# Altium schematic sheet 1S 2S.SchDoc
size A4; SheetNumber: 5; SheetTotal: 8
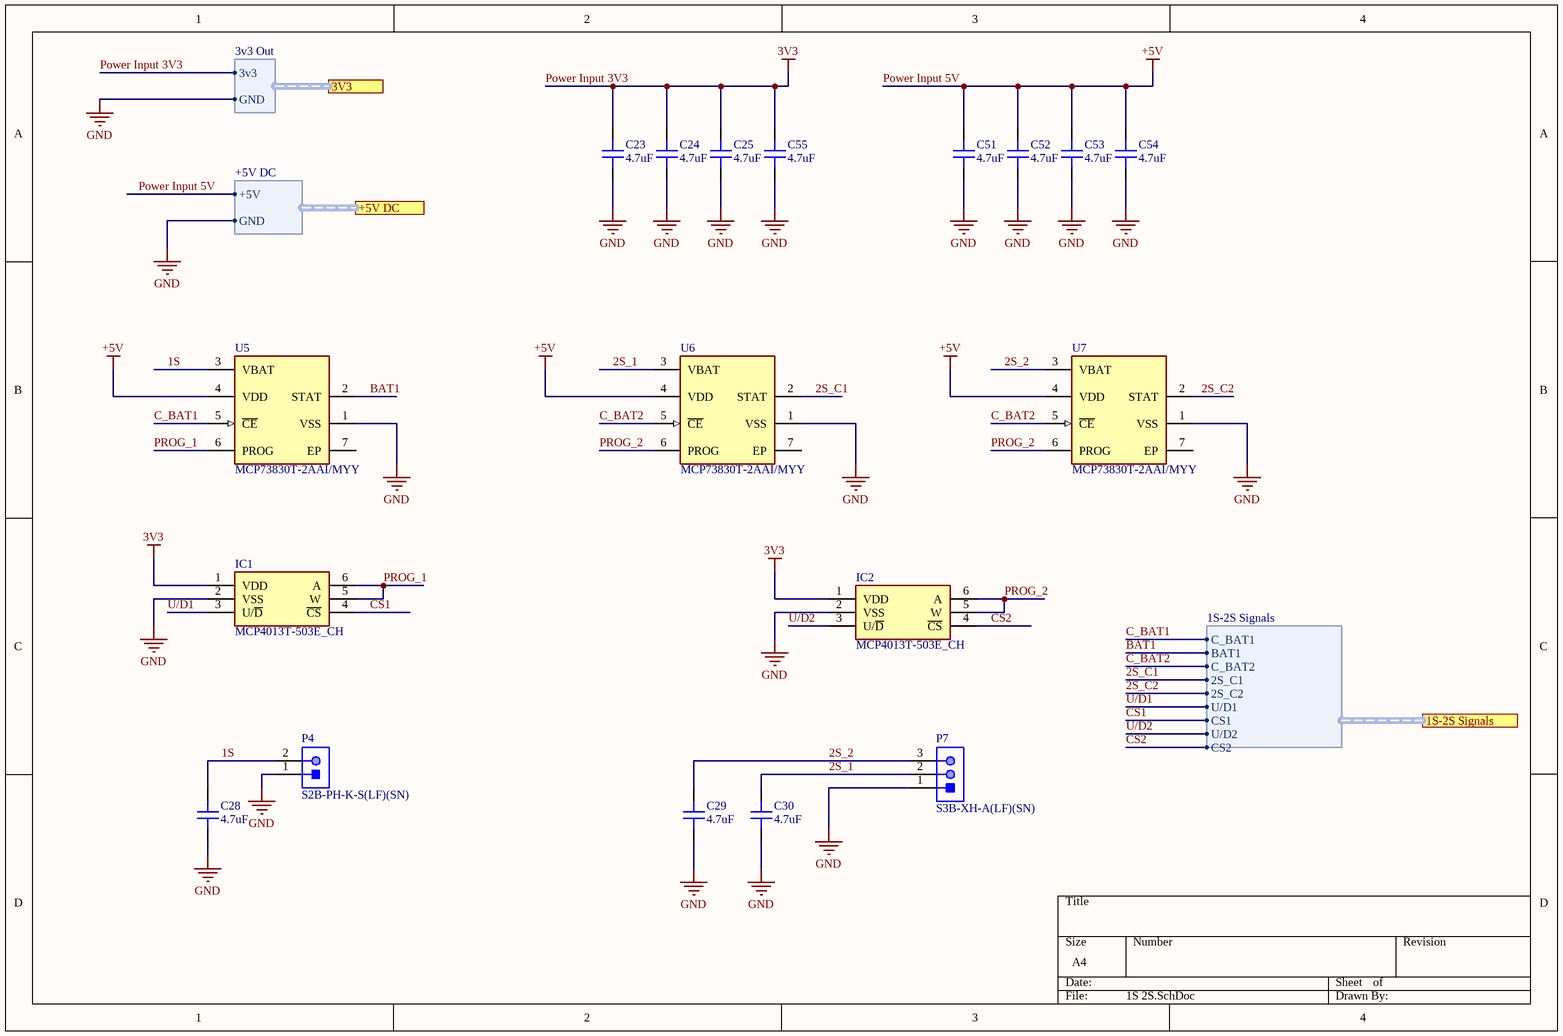
[diagram p0: 1S 2S.SchDoc]

## Parts
C23  4.7uF  [CAP 0603_1608]
C24  4.7uF  [CAP 0603_1608]
C25  4.7uF  [CAP 0603_1608]
C28  4.7uF  [CAP 0603_1608]
C29  4.7uF  [CAP 0603_1608]
C30  4.7uF  [CAP 0603_1608]
C51  4.7uF  [CAP 0603_1608]
C52  4.7uF  [CAP 0603_1608]
C53  4.7uF  [CAP 0603_1608]
C54  4.7uF  [CAP 0603_1608]
C55  4.7uF  [CAP 0603_1608]
IC1  MCP4013T-503E_CH  [SOT95P280X145-6N]
IC2  MCP4013T-503E_CH  [SOT95P280X145-6N]
P4  S2B-PH-K-S(LF)(SN)  [JST-S2B-PH-K-S_V]
P7  S3B-XH-A(LF)(SN)  [JST-S3B-XH-A(LF)(SN)_V]
U5  MCP73830T-2AAI/MYY  [FP-C04-078-IPC_B]
U6  MCP73830T-2AAI/MYY  [FP-C04-078-IPC_B]
U7  MCP73830T-2AAI/MYY  [FP-C04-078-IPC_B]

## Ports
1S-2S Signals (harness 1S-2S Signals), 3V3 (harness 3v3 Out), +5V DC (harness +5V DC)

## Harnesses
1S-2S Signals: C_BAT1, BAT1, 2S_C1, C_BAT2, 2S_C2, U/D1, CS1, U/D2, CS2
3v3 Out: 3v3, GND
+5V DC: +5V, GND

## Nets
GND: C23.1 C24.1 C25.1 C28.1 C29.1 C30.1 C51.1 C52.1 C53.1 C54.1 C55.1 IC1.2(VSS) IC2.2(VSS) P4.1 P7.1 U5.1(VSS) U6.1(VSS) U7.1(VSS) ; port 3V3.GND, port +5V DC.GND
Power Input 3V3: C23.2 C24.2 C25.2 C55.2 IC1.1(VDD) IC2.1(VDD) ; port 3V3.3v3  [also labelled 3V3]
Power Input 5V: C51.2 C52.2 C53.2 C54.2 U5.4(VDD) U6.4(VDD) U7.4(VDD) ; port +5V DC.+5V  [also labelled +5V]
1S: C28.2 P4.2 U5.3(VBAT)
2S_1: C30.2 P7.2 U6.3(VBAT)
2S_2: C29.2 P7.3 U7.3(VBAT)
2S_C1: U6.2(STAT) ; port 1S-2S Signals.2S_C1
2S_C2: U7.2(STAT) ; port 1S-2S Signals.2S_C2
BAT1: U5.2(STAT) ; port 1S-2S Signals.BAT1
C_BAT1: U5.5(~{CE}) ; port 1S-2S Signals.C_BAT1
C_BAT2: U6.5(~{CE}) U7.5(~{CE}) ; port 1S-2S Signals.C_BAT2
CS1: IC1.4(~{CS}) ; port 1S-2S Signals.CS1
CS2: IC2.4(~{CS}) ; port 1S-2S Signals.CS2
PROG_1: IC1.5(W) IC1.6(A) U5.6(PROG)
PROG_2: IC2.5(W) IC2.6(A) U6.6(PROG) U7.6(PROG)
U/D1: IC1.3(U/~{D}) ; port 1S-2S Signals.U/D1
U/D2: IC2.3(U/~{D}) ; port 1S-2S Signals.U/D2

Not connected (* = marked no-connect by the designer): U5 7(EP); U6 7(EP); U7 7(EP)

## Library data of the parts
C23-C25 C28-C30 C51-C55 = C0603X101F5GACAUTO: CAP CER 100PF 50V C0G/NP0 0603; Manufacturer: KEMET; Temperature Coefficient: C0G, NP0; Tolerance: ±1%; Part Number: C0603X101F5GACAUTO; Value: 4.7uF; Applications: Automotive, Boardflex Sensitive; Capacitance: 100pF; ComponentLink1Description: Datasheet; ComponentLink1URL: https://api.kemet.com/component-edge/download/datasheet/C0603X101F5GACAUTO.pdf; ComponentLink2Description: DigiKey Link; ComponentLink2URL: http://digikey.com/product-detail/en/kemet/C0603X101F5GACAUTO/399-20434-1-ND/9925038; Device Package: 0603 (1608 Metric); Features: Low ESL, Soft Termination; LastUpdated: 2.09.2020 01:03:36; Lifecycle Status: Active; Minimum Order: 1; Mounting Type: Surface Mount, MLCC; Operating Temperature: -55°C ~ 125°C; Package / Case: 0603 (1608 Metric); Packaging: TapeAndReel; PartId: 2136; Part Status: Active; Price: 0.44; Ratings: AEC-Q200; Series: SMD Auto C0G Flex; Size / Dimension: 0.063" L x 0.031" W (1.60mm x 0.80mm); Supplier 1: DigiKey; Supplier Part Number 1: 399-20434-1-ND; Thickness (Max): 0.037" (0.95mm); Voltage - Rated: 50V
IC1 IC2 = MCP4013T-503E_CH: Integrated Circuit; Manufacturer_Name: Microchip; Manufacturer_Part_Number: MCP4013T-503E/CH; Datasheet Link: https://componentsearchengine.com/Datasheets/2/MCP4013T-503E_CH.pdf; Height: 1.45mm; Mouser Part Number: 579-MCP4013T-503E/CH; Mouser Price/Stock: https://www.mouser.co.uk/ProductDetail/Microchip-Technology/MCP4013T-503E-CH/?qs=usxtMOJb1Rw%252Bngb68X6Q6A%3D%3D; Arrow Part Number: MCP4013T-503E/CH; Arrow Price/Stock: https://www.arrow.com/en/products/mcp4013t-503ech/microchip-technology
P4 = CMP-1755-00004-1: Male Header, Pitch 2 mm, 1 x 2 Position, Height 4.8 mm, Tail Length 3.4 mm, -25 to 85 degC, RoHS, Bulk; Case\Package: Radial; Tolerance: 20%; Capacitance: 10 uF; Voltage Rating (DC): 50 V; Packaging: Bulk; ComponentLink1URL: http://www.jst-mfg.com/product/pdf/eng/ePH.pdf; Radiation Hardening: No; Height: 11 mm; Package Quantity: 200; PackageDescription: Male Header, Pitch 2 mm, 1 x 2 Position, Height 4.8 mm, Tail Length 3.4 mm; PackageReference: S2B-PH-K-S; Diameter: 5 mm; Pins: 2; Mount: Through Hole; Max Operating Temperature: 85 degC; Min Operating Temperature: -40 degC; ComponentLink1Description: Datasheet; DatasheetVersion: Dec-12; Length: 11 mm; Lead Pitch: 2 mm; REACH SVHC: No SVHC; Voltage Rating: 50 V; RoHSCompliant: true
P7 = CMP-1755-00006-1: Male Header, Pitch 2.5 mm, 1 x 3 Position, Height 6.1 mm, Tail Length 3.4 mm, -25 to 85 degC, RoHS, Bulk; Min Supply Voltage: 1 V; Frequency: 1.8 MHz; Channels: 1; Nominal Supply Current: 170 uA; Max Power Dissipation: 1 W; Max Ouput Current: -10 mA; Case\Package: DIP; Max Supply Voltage: 15 V; Min Operating Temperature: 0 degC; Weight: 0.015535 oz; Radiation Hardening: No; ComponentLink1URL: http://www.jst.com/home2.html; PackageReference: S3B-XH-A(LF)(SN); Length: 9.81 mm; Max Operating Temperature: 70 degC; Package Quantity: 50; REACH SVHC: No SVHC; Mount: Through Hole; Pins: 8; Height: 4.57 mm; DatasheetVersion: May-16; ComponentLink1Description: Manufacturer URL; PackageDescription: Male Header, Pitch 2.5 mm, 1 x 3 Position, Height 6.1 mm, Tail Length 3.4 mm; RoHSCompliant: true; Packaging: Rail/Tube; Width: 6.35 mm; ComponentLink2URL: http://www.jst-mfg.com/product/pdf/eng/eXH.pdf; ComponentLink2Description: Datasheet
U5-U7 = CMP-06318-000001-1: IC BATT MGMT LI-ION 1A 6TDFN; Manufacturer: Microchip; Max Junction Temp: +125°C; Min Supply Voltage: 3.75V; Max Supply Voltage: 6V; Standoff Height: 0mm; Number Of Outputs: 1; Output Current: 1000mA; Output Voltage: 4.2V; Nominal Supply Current: 500uA; Package: C04-078; Mouser Description: Battery Charge Management Controller Li-Ion/Li-Pol 6-Pin TDFN EP T/R; Lead Free: Yes; Temperature Range High: +85°C; Height: 0.8mm; Ipc Land Pattern Name: DFN200X200X75-6; Ambient Temperature Range Low: -40°C; Manufacturer Part Number: MCP73830T-2AAI/MYY; Octopart: https://octopart.com/mcp73830t-2aai%2Fmyy-microchip-20908428; Device Class L1: Integrated Circuits (ICs); Digikey Description: IC BATT MGMT LI-ION 1A 6TDFN; Category: IC; Device Class L3: Battery Management; Device Class L2: Power Management ICs; ComponentLink2URL: http://ww1.microchip.com/downloads/en/DeviceDoc/MCP73830-L-Data-Sheet-DS20005049E.pdf; Ambient Temperature Range High: +85°C; Temperature Range Low: -40°C; ComponentLink2Description: Datasheet; Temperature: -40°C to +85°C; RoHS: TRUE; Number Of Cells: 1; Automotive: No